# EasyEDA Pro project esp32-board.epro

# Schematic esp32-s3-lite
Board Name: Board1; Create Date: 2025-02-08; Page Name: P1; Project Name: esp32-s3-lite-v4; Schematic Name: esp32-s3-lite; Update Date: 2025-04-16; Company: EasyEDA.com; Drawn: EasyEDA; Page Size: A4; Part Number: JLCPCB-002; Reviewed: EasyEDA; Version: V0.1
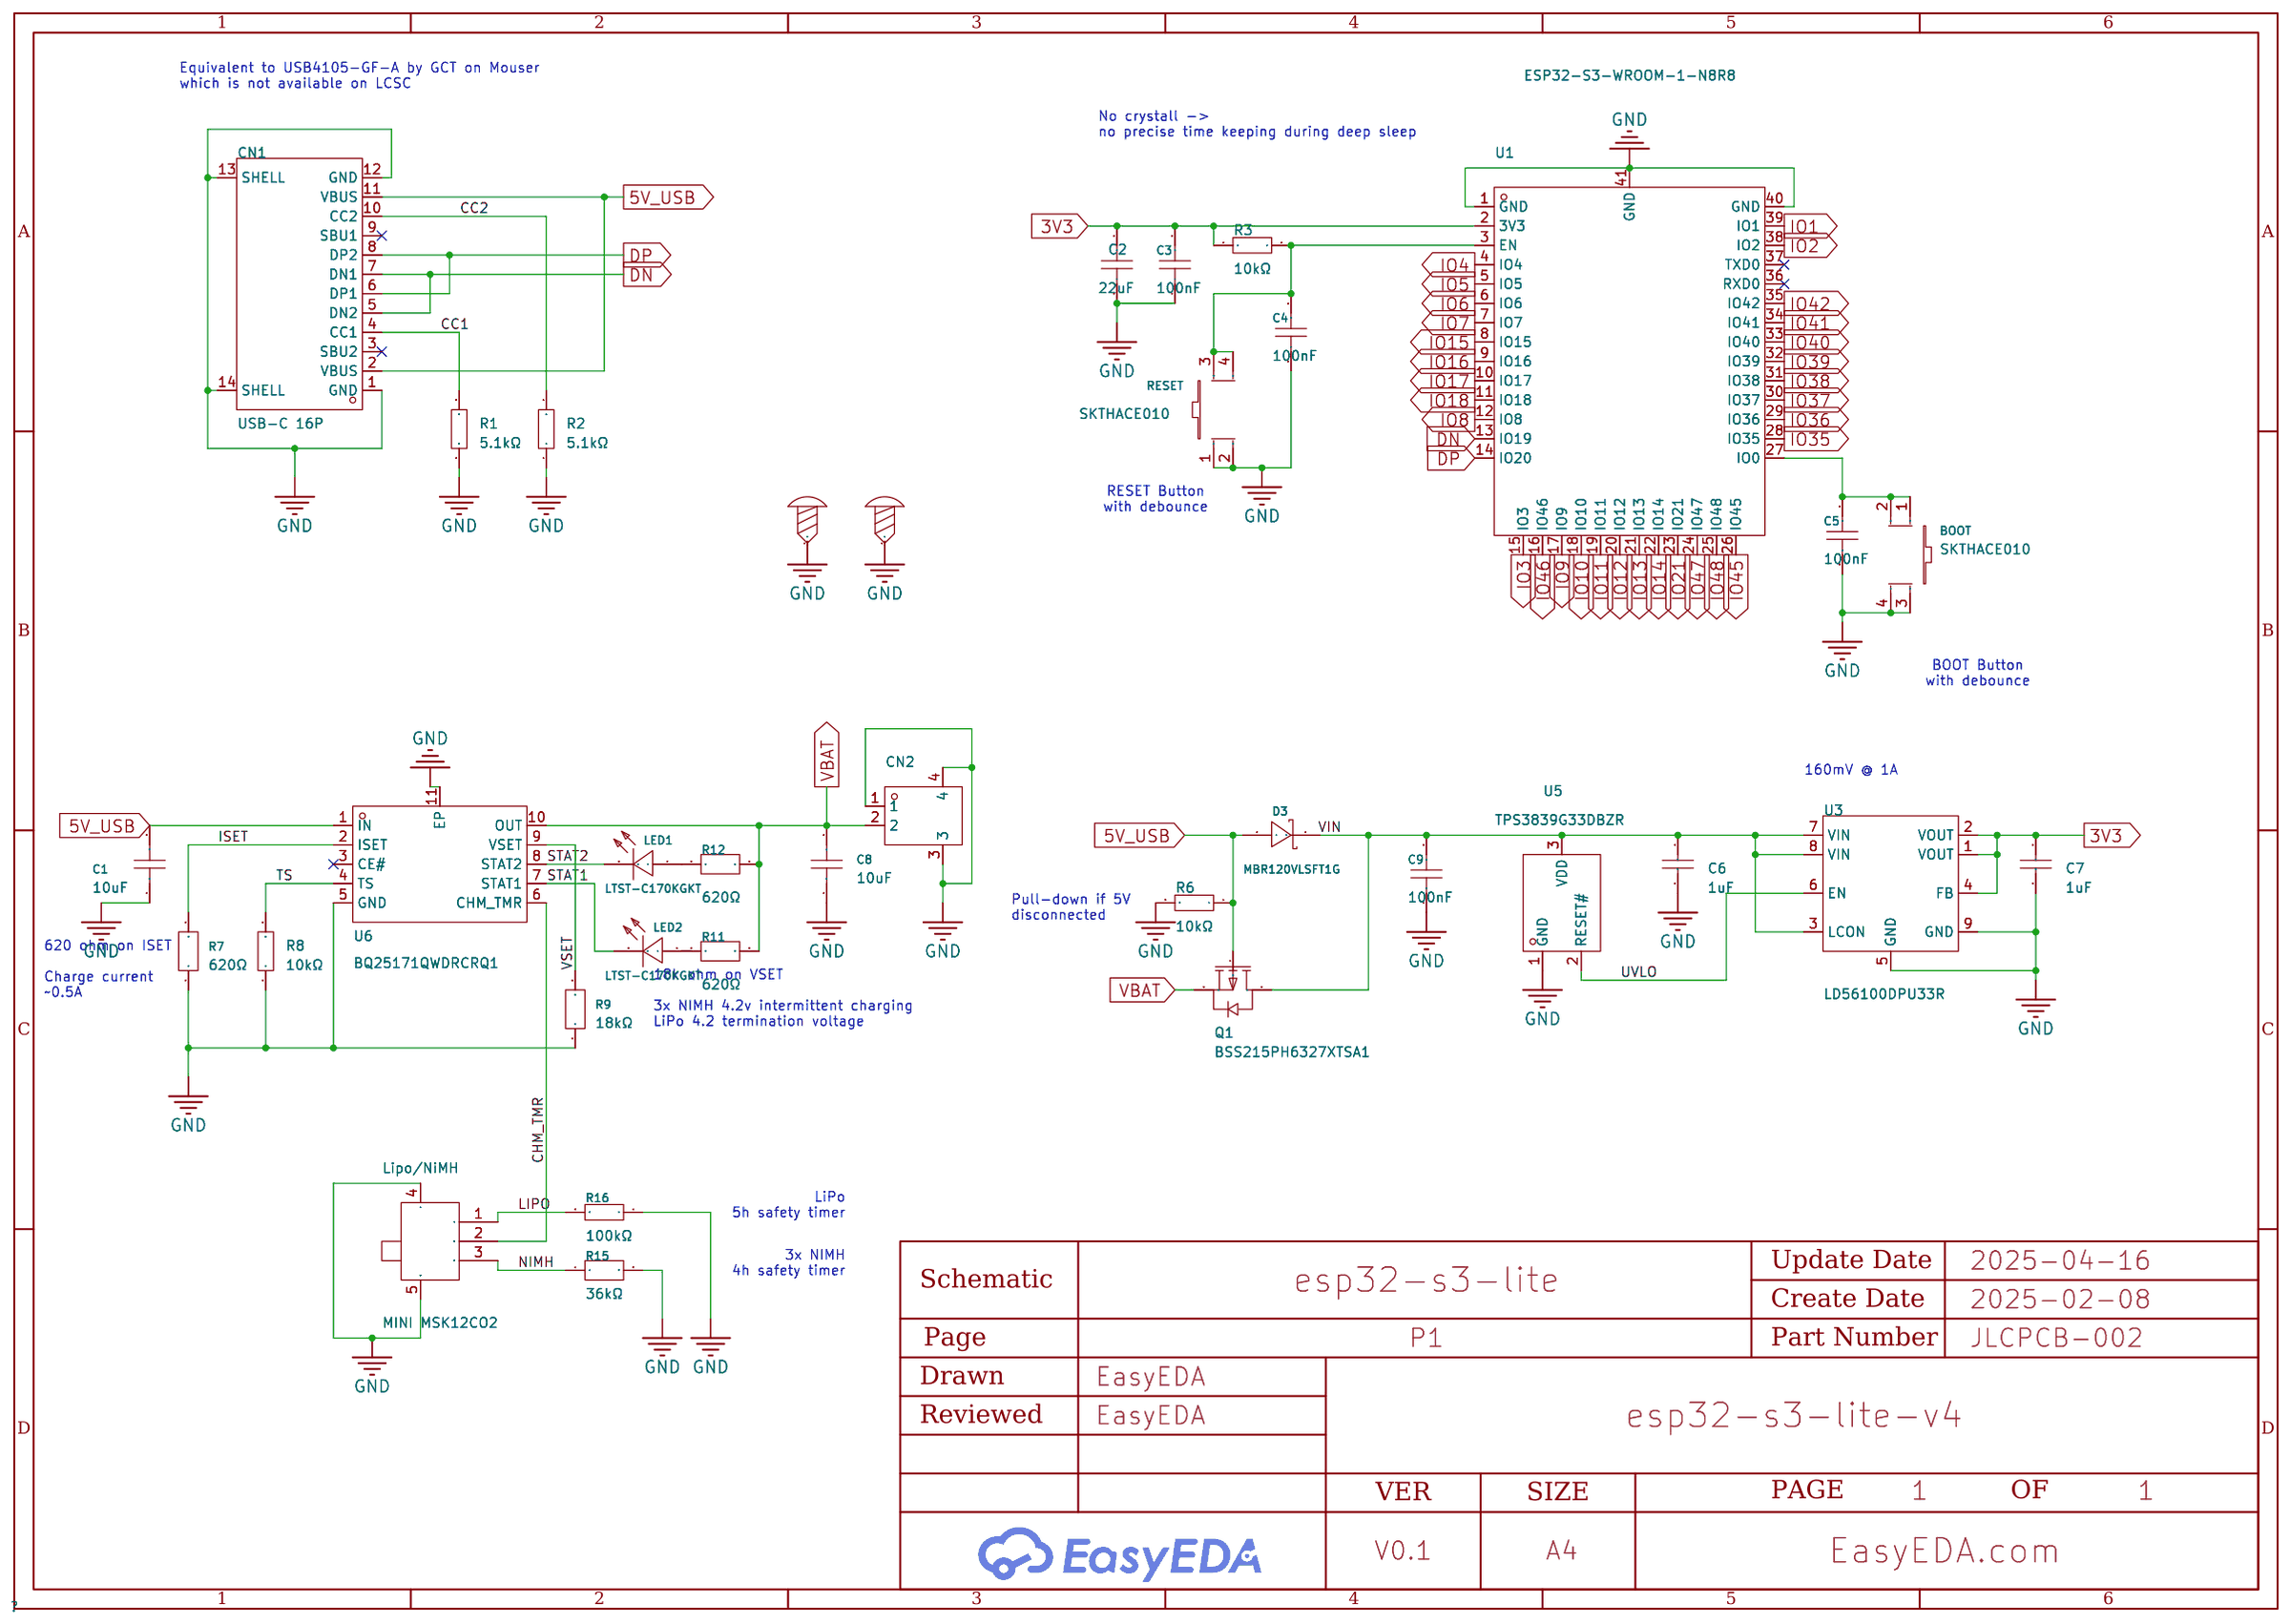
[diagram p0: schematic sheet]

## Parts
BOOT  SKTHACE010  [KEY-SMD_4P-L3.5-W3.2-P1.50-LS3.60]
C1  10uF  [C0603]
C2  22uF  [C0603]
C3  100nF  [C0603]
C4  100nF  [C0603]
C5  100nF  [C0603]
C6  1uF  [C0603]
C7  1uF  [C0603]
C8  10uF  [C0603]
C9  100nF  [C0603]
CN1  USB-C 16P  [USB-C-SMD_TYPE-C-6PIN-2MD-073]
CN2  B2B-PH-SM4-TB(LF)(SN)  [CONN-SMD_B2B-PH-SM4-TB-LF-SN]
D3  MBR120VLSFT1G  [SOD-123F_L2.8-W1.8-LS3.7-RD]
LED1  LTST-C170KGKT  [LED0805-R-RD]
LED2  LTST-C170KGKT  [LED0805-R-RD]
Lipo/NiMH  MINI MSK12CO2  [SW-SMD_MSK12CO2]
Q1  BSS215PH6327XTSA1  [SOT-23-3_L2.9-W1.3-P1.90-LS2.4-BR]
R1  5.1kΩ  [R0603]
R2  5.1kΩ  [R0603]
R3  10kΩ  [R0603]
R6  10kΩ  [R0603]
R7  620Ω  [R0603]
R8  10kΩ  [R0603]
R9  18kΩ  [R0603]
R11  620Ω  [R0603]
R12  620Ω  [R0603]
R15  36kΩ  [R0603]
R16  100kΩ  [R0603]
RESET  SKTHACE010  [KEY-SMD_4P-L3.5-W3.2-P1.50-LS3.60]
SCREW1  -  [Screw-Hole-M2]
SCREW2  -  [Screw-Hole-M2]
U1  ESP32-S3-WROOM-1-N8R8  [WIRELM-SMD_ESP32-S3-WROOM-1]
U3  LD56100DPU33R  [XDFN-8_L1.6-W1.2-P0.40-BL-EP]
U5  TPS3839G33DBZR  [SOT-23-3_L2.9-W1.3-P1.90-LS2.4-BR]
U6  BQ25171QWDRCRQ1  [VSON-10_L3.0-W3.0-P0.50-BL-EP1.65]

## Library data of the parts
BOOT RESET = SKTHACE010: Circuit:SPST Actuator Style:Oval button Mounting Style:Brick nogging Switch Length:3.5mm Switch Width:3.2mm Switch Height:2.5mm Contact Current:25mA Voltage Rating (DC):16V With Lamp:- Mechanical Life:-; LCSC Part Name: 3.5*3.2*2.5mm 立贴 轻触开关; Supplier Part: C341729; Manufacturer: ALPSALPINE(阿尔卑斯阿尔派); Supplier Footprint: SMD; JLCPCB Part Class: Extended Part; Datasheet: https://atta.szlcsc.com/upload/public/pdf/source/20181207/C341729_BBC92D894F29994D0AEA1AC6AF4EADEA.pdf; Supplier: LCSC; Circuit: SPST; Actuator Style: Oval button; Mounting Style: Brick nogging; Switch Length: 3.5mm; Switch Width: 3.2mm; Switch Height: 2.5mm; Contact Current: 25mA; Voltage Rating (DC): 16V
C1 C8 = CL10A106MA8NRNC: Capacitance: Tolerance:±20% Tolerance:±20% Voltage Rated: Temperature Coefficient:; LCSC Part Name: 10uF ±20% 25V; Supplier Part: C96446; Manufacturer: SAMSUNG(三星); Supplier Footprint: 0603; JLCPCB Part Class: Basic Part; Datasheet: https://atta.szlcsc.com/upload/public/pdf/source/20160218/1457707763339.pdf; Supplier: LCSC; Tolerance: ±20%
C2 = CL10A226MP8NUNE: Capacitance: Tolerance:±20% Tolerance:±20% Voltage Rated: Temperature Coefficient:; LCSC Part Name: 22uF ±20% 10V; Supplier Part: C86295; Manufacturer: SAMSUNG(三星); Supplier Footprint: 0603; JLCPCB Part Class: Extended Part; Datasheet: https://atta.szlcsc.com/upload/public/pdf/source/20160218/1457707763339.pdf; Supplier: LCSC; Tolerance: ±20%
C3-C5 C9 = CL10B104KB8NNNC: Capacitance: Tolerance:±10% Tolerance:±10% Voltage Rated: Temperature Coefficient:; LCSC Part Name: 100nF ±10% 50V; Supplier Part: C1591; Manufacturer: SAMSUNG(三星); Supplier Footprint: 0603; JLCPCB Part Class: Extended Part; Datasheet: https://atta.szlcsc.com/upload/public/pdf/source/20160218/1457707763339.pdf; Supplier: LCSC; Tolerance: ±10%
C6 C7 = CL10A105KA8NNNC: Capacitance: Tolerance:±10% Tolerance:±10% Voltage Rated: Temperature Coefficient:; LCSC Part Name: 1uF ±10% 25V; Supplier Part: C5673; Manufacturer: SAMSUNG(三星); Supplier Footprint: 0603; JLCPCB Part Class: Extended Part; Datasheet: https://atta.szlcsc.com/upload/public/pdf/source/20160218/1457707763339.pdf; Supplier: LCSC; Tolerance: ±10%
CN1 = TYPE-C 16PIN 2MD(073): Connector Type:Type-C Standard:USB 3.1 Gender:Female Mounting Style:Horizontal attachment Number of Contacts:16P Number of Ports:1 Current Rating - Power (Max):5A Operating Temperature Range:-25℃~+85℃ Operating Temperature Range:-25℃~+85℃ Rated Voltage (M; LCSC Part Name: Type-C 母 卧贴; Supplier Part: C2765186; Manufacturer: SHOU HAN(首韩); Supplier Footprint: SMD; JLCPCB Part Class: Extended Part; Datasheet: https://atta.szlcsc.com/upload/public/pdf/source/20211123/39B17C16241EAC15C5E277BDA434118E.pdf; Supplier: LCSC; Connector Type: Type-C; Standard: USB 3.1; Gender: Female; Mounting Style: Horizontal attachment; Number of Contacts: 16P; Number of Ports: 1; Current Rating - Power (Max): 5A; Operating Temperature Range: -25℃~+85℃; Rated Voltage (Max): 5V; Connect-Disconnect Life: 5000 Cuts; Core Colour: Black
CN2 = B2B-PH-SM4-TB(LF)(SN): Pins Structure:1x2P Pitch:2mm Mounting Style:Brick nogging Reference Series:PH Number of Pins:2P Number of Rows:1 Number of PINs Per Row:2 Row Spacing:- Current Rating (Max):2A Contact Material:Copper Alloy Contact Plating:Tin Operating Temperature Range:; LCSC Part Name: 1x2P 间距:2mm 立贴 系列:PH; Supplier Part: C160352; Manufacturer: JST; Supplier Footprint: SMD,P=2mm; JLCPCB Part Class: Extended Part; Datasheet: https://atta.szlcsc.com/upload/public/pdf/source/20181010/C265101_22107ACC4D8714694FDA2DD97145FA81.pdf; Supplier: LCSC; Pins Structure: 1x2P; Pitch: 2mm; Mounting Style: Brick nogging; Reference Series: PH; Number of Pins: 2P; Number of Rows: 1; Number of PINs Per Row: 2; Current Rating (Max): 2A; Contact Material: Copper Alloy; Contact Plating: Tin; Operating Temperature Range: -25℃~+85℃; Rated Voltage (Max): 100V; Plastic Material: PA; Flame Retardant Rating: UL94V-0; Supplementary Features: 辅助焊脚; Colour: 米色; Z-Height of the Board: 6.6mm; X-Length of Bottom Edge on Board (Spacing Line): 7.95mm; Y-Width of Bottom Edge on Board: 7mm
D3 = MBR120VLSFT1G: Forward Voltage (Vf@If):300mV@1A Reverse Voltage (Vr):20V Average Rectified Current (Io):1A Reverse Leakage Current (Ir):600uA@20V; LCSC Part Name: 电压:20V 电流:1A; Supplier Part: C223608; Manufacturer: onsemi(安森美); Supplier Footprint: SOD-123FL; JLCPCB Part Class: Extended Part; Datasheet: https://atta.szlcsc.com/upload/public/pdf/source/20221020/29D26ECD33A75D76A8E47ED9553F3BCF.pdf; Supplier: LCSC; Forward Voltage (Vf@If): 300mV@1A; Reverse Voltage (Vr): 20V; Average Rectified Current (Io): 1A; Reverse Leakage Current (Ir): 600uA@20V
LED1 LED2 = LTST-C170KGKT: Emitted Color:Green-yellow Forward Voltage (VF):2V Forward Voltage (VF):2V Power Dissipation:75mW Forward Current:20mA Dominant Wavelength:571nm Dominant Wavelength:571nm Peak Wavelength:574nm Diode Configuration:- Lens Color:无色透明透镜 Color Temperature:- Co; LCSC Part Name: 普绿/黄绿; Supplier Part: C98221; Manufacturer: LITEON(光宝); Supplier Footprint: 0805; JLCPCB Part Class: Extended Part; Datasheet: https://atta.szlcsc.com/upload/public/pdf/source/20180129/C98221_15171889648161316610.pdf; Supplier: LCSC; Emitted Color: Green-yellow; Forward Voltage (VF): 2V; Power Dissipation: 75mW; Forward Current: 20mA; Dominant Wavelength: 571nm; Peak Wavelength: 574nm; Lens Color: 无色透明透镜; Luminous Intensity: 35mcd; Viewing Angle: 130°; Operating Temperature: -55℃~+85℃
Lipo/NiMH = MINI MSK12CO2: Circuit:SPDT Actuator Style:- Pin Style:SMDSplicing Switch Length:5mm Switch Width:2.75mm Switch Height:1.4mm Mounting Style:卧贴 Actuator Color:- Current Rating (DC):50mA Voltage Rating (DC):12V Current Rating (AC):- Voltage Rating (AC):- Mechanical Life:1; LCSC Part Name: 迷你七脚两档侧拨拨动 mini七7脚 微型拨动; Supplier Part: C2681570; Manufacturer: SHOU HAN(首韩); Supplier Footprint: SMD; JLCPCB Part Class: Extended Part; Datasheet: https://atta.szlcsc.com/upload/public/pdf/source/20210224/C2681570_D263F9C605E4588A4AE6114B72AE4C72.pdf; Supplier: LCSC; Circuit: SPDT; Pin Style: SMDSplicing; Switch Length: 5mm; Switch Width: 2.75mm; Switch Height: 1.4mm; Mounting Style: 卧贴; Current Rating (DC): 50mA; Voltage Rating (DC): 12V; Mechanical Life: 1万次; Operating Temperature: -16℃~+60℃
Q1 = BSS215PH6327XTSA1: Type:1 Piece P-Channel Drain Source Voltage (Vdss):20V Continuous Drain Current (Id): Power Dissipation (Pd): Drain Source On Resistance (RDS(on)@Vgs,Id): Gate Threshold Voltage (Vgs(th)@Id):1.2V@11uA Total Gate Charge (Qg@Vgs):3.6nC@4.5V Input Capacitanc; LCSC Part Name: 1个P沟道 耐压:20V 电流:1.5A; Supplier Part: C152736; Manufacturer: Infineon(英飞凌); Supplier Footprint: SOT-23; JLCPCB Part Class: Extended Part; Datasheet: https://atta.szlcsc.com/upload/public/pdf/source/20200519/C534615_D0AFB7F4007BEC6B6D76BB5D3CF0A1A2.pdf; Supplier: LCSC; Type: 1 Piece P-Channel; Drain Source Voltage (Vdss): 20V; Gate Threshold Voltage (Vgs(th)@Id): 1.2V@11uA; Total Gate Charge (Qg@Vgs): 3.6nC@4.5V; Input Capacitance (Ciss@Vds): 346pF@15V; Operating Temperature: -55℃~+150℃@(Tj)
R1 R2 = RT0603BRD075K1L: Type:Thin Film Resistor Resistance: Tolerance:±0.1% Tolerance:±0.1% Power(Watts): Overload Voltage (Max): Temperature Coefficient:±25ppm/℃ Temperature Coefficient:±25ppm/℃ Operating Temperature Range:-55℃~+155℃ Operating Temperature Range:-55℃~+155℃; LCSC Part Name: 薄膜电阻 5.1kΩ ±0.1% 100mW; Supplier Part: C122969; Manufacturer: YAGEO(国巨); Supplier Footprint: 0603; JLCPCB Part Class: Extended Part; Datasheet: https://atta.szlcsc.com/upload/public/pdf/source/20170728/C122969_1501225761505848820.pdf; Supplier: LCSC; Type: Thin Film Resistor; Tolerance: ±0.1%; Temperature Coefficient: ±25ppm/℃; Operating Temperature Range: -55℃~+155℃
R3 R6 R8 = RT0603BRD0710KL: Type:Thin Film Resistor Resistance: Tolerance:±0.1% Tolerance:±0.1% Power(Watts): Overload Voltage (Max): Temperature Coefficient:±25ppm/℃ Temperature Coefficient:±25ppm/℃ Operating Temperature Range:-55℃~+155℃ Operating Temperature Range:-55℃~+155℃; LCSC Part Name: 薄膜电阻 10kΩ ±0.1% 100mW; Supplier Part: C95204; Manufacturer: YAGEO(国巨); Supplier Footprint: 0603; JLCPCB Part Class: Extended Part; Datasheet: https://atta.szlcsc.com/upload/public/pdf/source/20170217/1487301593756.pdf; Supplier: LCSC; Type: Thin Film Resistor; Tolerance: ±0.1%; Temperature Coefficient: ±25ppm/℃; Operating Temperature Range: -55℃~+155℃
R7 R11 R12 = ERJ3EKF6200V: Type:Thick Film Resistors Resistance: Tolerance:±1% Tolerance:±1% Power(Watts): Overload Voltage (Max):- Temperature Coefficient:±100ppm/℃ Temperature Coefficient:±100ppm/℃ Operating Temperature Range:-55℃~+155℃ Operating Temperature Range:-55℃~+155℃; LCSC Part Name: 620Ω ±1% 100mW 厚膜电阻; Supplier Part: C403304; Manufacturer: PANASONIC(松下); Supplier Footprint: 0603; JLCPCB Part Class: Extended Part; Datasheet: https://atta.szlcsc.com/upload/public/pdf/source/20190709/C403410_4AA7B6683950D876CE9308C181828FCD.pdf; Supplier: LCSC; Type: Thick Film Resistors; Tolerance: ±1%; Temperature Coefficient: ±100ppm/℃; Operating Temperature Range: -55℃~+155℃
R9 = ERJ3EKF1802V: Type:Thick Film Resistors Resistance:18kΩ Tolerance:±1% Tolerance:±1% Power(Watts): Overload Voltage (Max): Temperature Coefficient:±100ppm/℃ Temperature Coefficient:±100ppm/℃ Operating Temperature Range:-55℃~+155℃ Operating Temperature Range:-55℃~+155℃; LCSC Part Name: 18kΩ ±1% 100mW 厚膜电阻; Supplier Part: C403034; Manufacturer: PANASONIC(松下); Supplier Footprint: 0603; JLCPCB Part Class: Extended Part; Datasheet: https://atta.szlcsc.com/upload/public/pdf/source/20190709/C403410_4AA7B6683950D876CE9308C181828FCD.pdf; Supplier: LCSC; Type: Thick Film Resistors; Tolerance: ±1%; Temperature Coefficient: ±100ppm/℃; Operating Temperature Range: -55℃~+155℃
R15 = ERJ3EKF3602V: Type:Thick Film Resistors Resistance:36kΩ Tolerance:±1% Tolerance:±1% Power(Watts): Overload Voltage (Max):- Temperature Coefficient:±100ppm/℃ Temperature Coefficient:±100ppm/℃ Operating Temperature Range:-55℃~+155℃ Operating Temperature Range:-55℃~+155℃; LCSC Part Name: 36kΩ ±1% 100mW 厚膜电阻; Supplier Part: C403181; Manufacturer: PANASONIC(松下); Supplier Footprint: 0603; JLCPCB Part Class: Extended Part; Datasheet: https://atta.szlcsc.com/upload/public/pdf/source/20190709/C403410_4AA7B6683950D876CE9308C181828FCD.pdf; Supplier: LCSC; Type: Thick Film Resistors; Tolerance: ±1%; Temperature Coefficient: ±100ppm/℃; Operating Temperature Range: -55℃~+155℃
R16 = ERJ3EKF1003V: Type:Thick Film Resistors Resistance:100kΩ Tolerance:±1% Tolerance:±1% Power(Watts): Overload Voltage (Max):- Temperature Coefficient:±100ppm/℃ Temperature Coefficient:±100ppm/℃ Operating Temperature Range:-55℃~+155℃ Operating Temperature Range:-55℃~+155℃; LCSC Part Name: 100kΩ ±1% 100mW 厚膜电阻; Supplier Part: C189597; Manufacturer: PANASONIC(松下); Supplier Footprint: 0603; JLCPCB Part Class: Extended Part; Datasheet: https://atta.szlcsc.com/upload/public/pdf/source/20180524/C193239_FFEA89BB7F9859C8C42240F47AD03C60.pdf; Supplier: LCSC; Type: Thick Film Resistors; Tolerance: ±1%; Temperature Coefficient: ±100ppm/℃; Operating Temperature Range: -55℃~+155℃
SCREW1 SCREW2 = Screw-Hole-M2: Supplier Footprint: 插件
U1 = ESP32-S3-WROOM-1-N8R8: Supplier Part: C2913201; Manufacturer: ESPRESSIF(乐鑫); Supplier Footprint: SMD,25.5x18mm; JLCPCB Part Class: Extended Part; Datasheet: https://atta.szlcsc.com/upload/public/pdf/source/20240130/9D71F4DF55874C504AB629FEEE3F038E.pdf; Supplier: LCSC
U3 = LD56100DPU33R: Output Type:Fixed Maximum Input Voltage:5.5V Output Voltage:3.3V Output Voltage:3.3V Output Current:1A Dropout Voltage:160mV@(1A) standby current:155uA Feature:ESD Protection；Surge Protection；Short-Circuit  Protection；Low ESR；Thermal Protection(TSD)；Overc; LCSC Part Name: 1A超低压降快速静态超低噪声线性稳压器; Supplier Part: C2969937; Manufacturer: ST(意法半导体); Supplier Footprint: DFN-8(1.2x1.6); JLCPCB Part Class: Extended Part; Datasheet: https://atta.szlcsc.com/upload/public/pdf/source/20220927/260C14BB568125F608A31F1F8EA3901A.pdf; Supplier: LCSC; Output Type: Fixed; Maximum Input Voltage: 5.5V; Output Voltage: 3.3V; Output Current: 1A; Dropout Voltage: 160mV@(1A); standby current: 155uA; Feature: ESD Protection；Surge Protection；Short-Circuit  Protection；Low ESR；Thermal Protection(TSD)；Overcurrent Protection(OCP)；With ability; Operating Temperature: -40℃~+85℃; Output Polarity: Positive electrode; Number of Outputs: 1
U5 = TPS3839G33DBZR: ChipType:Simple reset/Power-on reset Output Type:推挽 Reset Active Level:低电平有效 Threshold Voltage:3.08V Number of Voltages Monitored:1 Reset Timeout:120ms Operating Temperature:-40℃~+85℃@(TA) Operating Temperature:-40℃~+85℃@(TA); Supplier Part: C485802; Manufacturer: TI(德州仪器); Supplier Footprint: SOT-23-3; JLCPCB Part Class: Extended Part; Datasheet: https://www.ti.com/cn/lit/gpn/tps3839; Supplier: LCSC; ChipType: Simple reset/Power-on reset; Output Type: 推挽; Reset Active Level: 低电平有效; Threshold Voltage: 3.08V; Number of Voltages Monitored: 1; Reset Timeout: 120ms; Operating Temperature: -40℃~+85℃@(TA)
U6 = BQ25171QWDRCRQ1: Supplier Part: C2861221; Manufacturer: TI(德州仪器); Supplier Footprint: VSON-10-EP(3x3); JLCPCB Part Class: Extended Part; Datasheet: https://www.ti.com/cn/lit/gpn/bq25171-q1; Supplier: LCSC

## Nets
3V3: C2.2 C3.2 C7.2 R3.1 U1.2(3V3) U3.1(VOUT) U3.2(VOUT) U3.4(FB)
5V_USB: C1.2 CN1.2(VBUS) CN1.11(VBUS) D3.2(A) Q1.1(G) R6.1 U6.1(IN)
GND: BOOT.3 BOOT.4 C1.1 C2.1 C3.1 C4.1 C5.1 C6.1 C7.1 C8.1 C9.1 CN1.1(GND) CN1.12(GND) CN1.13(SHELL) CN1.14(SHELL) CN2.1 CN2.3 CN2.4 Lipo/NiMH.4 Lipo/NiMH.5 R1.1 R2.1 R6.2 R7.1 R8.1 R9.1 R15.2 R16.1 RESET.1 RESET.2 SCREW1.1 SCREW2.1 U1.1(GND) U1.40(GND) U1.41(GND) U3.5(GND) U3.9(GND) U5.1(GND) U6.5(GND) U6.11(EP)
VBAT: C8.2 CN2.2 Q1.2(S) R11.2 R12.2 U6.10(OUT)
VIN: C6.2 C9.2 D3.1(K) Q1.3(D) U3.3(LCON) U3.7(VIN) U3.8(VIN) U5.3(VDD)
CC1: CN1.4(CC1) R1.2
CC2: CN1.10(CC2) R2.2
CHM_TMR: Lipo/NiMH.2 U6.6(CHM_TMR)
DN: CN1.5(DN2) CN1.7(DN1) U1.13(IO19)
DP: CN1.6(DP1) CN1.8(DP2) U1.14(IO20)
IO1: U1.39(IO1)
IO2: U1.38(IO2)
IO3: U1.15(IO3)
IO4: U1.4(IO4)
IO5: U1.5(IO5)
IO6: U1.6(IO6)
IO7: U1.7(IO7)
IO8: U1.12(IO8)
IO9: U1.17(IO9)
IO10: U1.18(IO10)
IO11: U1.19(IO11)
IO12: U1.20(IO12)
IO13: U1.21(IO13)
IO14: U1.22(IO14)
IO15: U1.8(IO15)
IO16: U1.9(IO16)
IO17: U1.10(IO17)
IO18: U1.11(IO18)
IO21: U1.23(IO21)
IO35: U1.28(IO35)
IO36: U1.29(IO36)
IO37: U1.30(IO37)
IO38: U1.31(IO38)
IO39: U1.32(IO39)
IO40: U1.33(IO40)
IO41: U1.34(IO41)
IO42: U1.35(IO42)
IO45: U1.26(IO45)
IO46: U1.16(IO46)
IO47: U1.24(IO47)
IO48: U1.25(IO48)
ISET: R7.2 U6.2(ISET)
LIPO: Lipo/NiMH.1 R16.2
NIMH: Lipo/NiMH.3 R15.1
STAT1: LED2.2(K) U6.7(STAT1)
STAT2: LED1.2(K) U6.8(STAT2)
TS: R8.2 U6.4(TS)
UVLO: U3.6(EN) U5.2(RESET#)
VSET: R9.2 U6.9(VSET)
$1N5784: C4.2 R3.2 RESET.3 RESET.4 U1.3(EN)
$1N5906: BOOT.1 BOOT.2 C5.2 U1.27(IO0)
$1N25469: LED2.1(A) R11.1
$1N25594: LED1.1(A) R12.1

Not connected (* = marked no-connect by the designer): CN1 3(SBU2)* 9(SBU1)*; U1 36(RXD0)* 37(TXD0)*; U6 3(CE#)*

## Notes on the sheet
- Equivalent to USB4105-GF-A by GCT on Mouser
  which is not available on LCSC
- No crystall ->
  no precise time keeping during deep sleep
- RESET Button
  with debounce
- BOOT Button
  with debounce
- 160mV @ 1A
- Pull-down if 5V
  disconnected
- 620 ohm on ISET
  Charge current
  ~0.5A
- 18k ohm on VSET
  3x NIMH 4.2v intermittent charging
  LiPo 4.2 termination voltage
- LiPo
  5h safety timer
- 3x NIMH
  4h safety timer

# Board PCB1
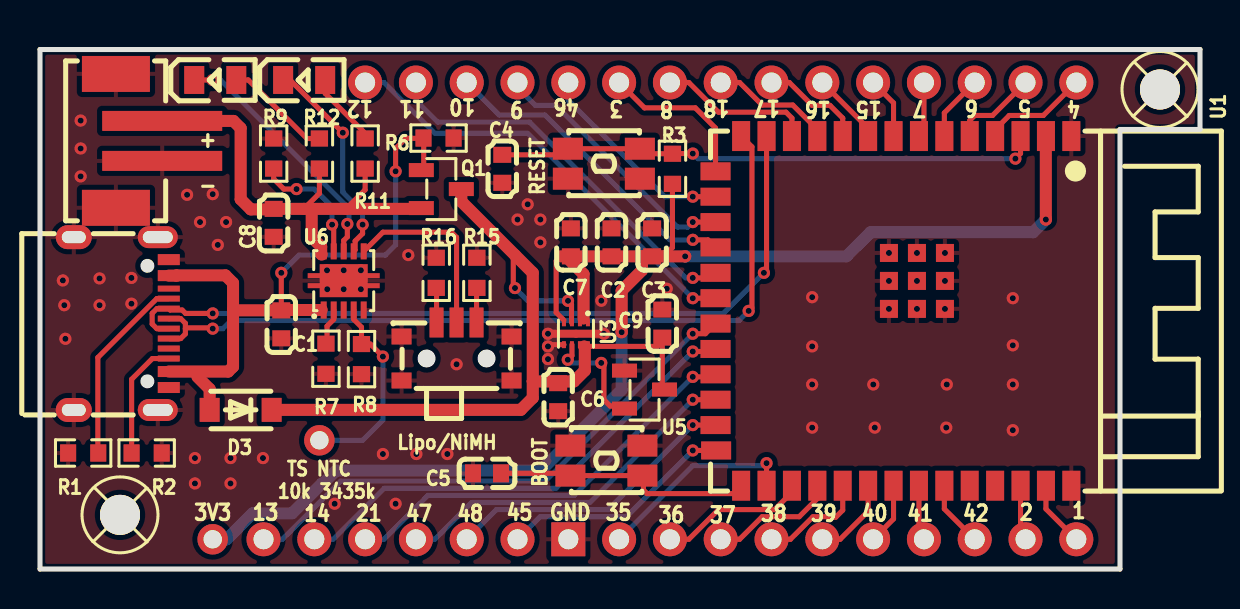
[diagram p1: board, top side]
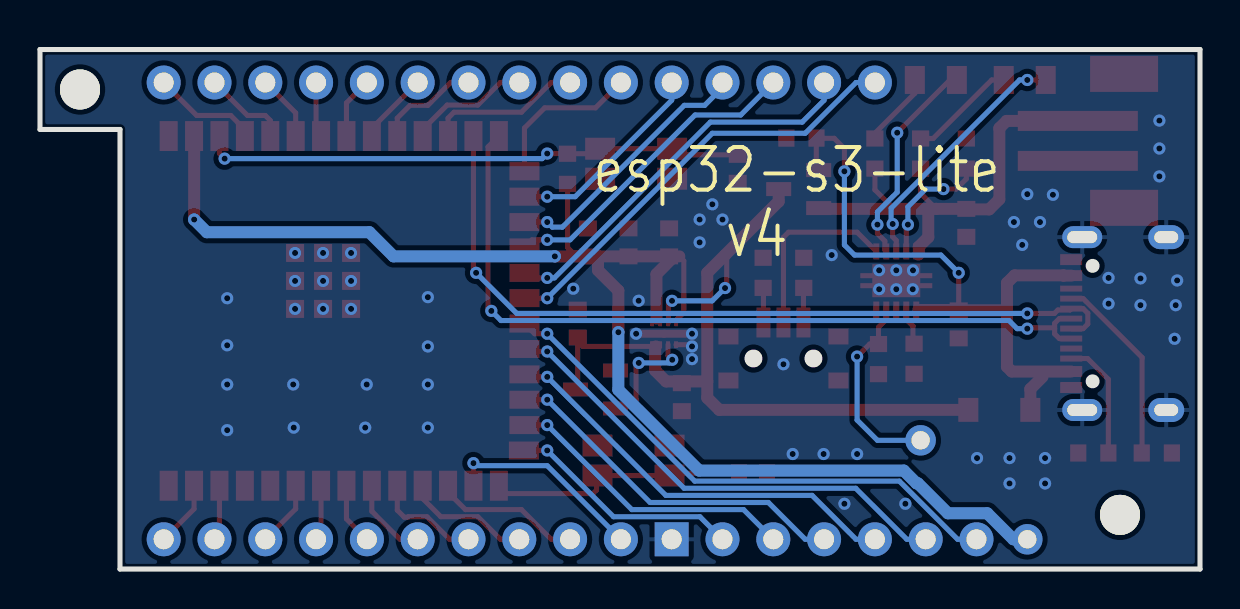
[diagram p2: board, bottom side, seen from below]

Outline 58 x 26 mm; copper layers: Top Layer, Inner1, Inner2, Bottom Layer. Coordinates in mm from the lower left corner of the outline.
Outline path: 0,26 58,26 58,22 54,22 54,0 0,0 0,26
Stack: Top Layer 0.035mm Outer layer thickness 1oz / Dielectric1 0.2104mm 7628 RC49% 8.6mil / Inner1 0.0152mm Inner layer thickness / Dielectric2 1.065mm 1.1mm H/HOZ Copper / Inner2 0.0152mm Inner layer thickness / Dielectric3 0.2104mm 7628 RC49% 8.6mil / Bottom Layer 0.035mm Outer layer thickness 1oz

## Design rules (mm)
template: Custom Config
spacing copperThickness1oz (default): track to track 0.102, other pairs 0.152 to 0.3
spacing copperThickness2oz: track to track 0.203, other pairs 0.152 to 0.3
track width copperThickness1oz (default): min 0.127, default 0.254, max 2.54
track width copperThickness2oz: min 0.203, default 0.254, max 2.54
differential pair differentialPair (default): width min 0.127, default 0.254, max 2.54; gap min 0.152, default 0.152
via viaSize (default): diameter min 0.5, default 0.61, max 10; hole min 0.3, default 0.305, max 6.3

## Placement (name value [footprint] x y rotation side)
BOOT  SKTHACE010  [KEY-SMD_4P-L3.5-W3.2-P1.50-LS3.60]  28.32 5.43 0 top
C1  10uF  [C0603]  12.06 12.25 90 top
C2  22uF  [C0603]  28.57 16.35 270 top
C3  100nF  [C0603]  30.61 16.35 270 top
C4  100nF  [C0603]  23.11 20.03 90 top
C5  100nF  [C0603]  22.35 4.79 0 top
C6  1uF  [C0603]  25.91 8.6 90 top
C7  1uF  [C0603]  26.54 16.35 270 top
C8  10uF  [C0603]  11.68 17.33 90 top
C9  100nF  [C0603]  31.12 12.28 270 top
CN1  USB-C 16P  [USB-C-SMD_TYPE-C-6PIN-2MD-073]  4.06 12.28 270 top
CN2  B2B-PH-SM4-TB(LF)(SN)  [CONN-SMD_B2B-PH-SM4-TB-LF-SN]  4.95 21.43 270 top
D3  MBR120VLSFT1G  [SOD-123F_L2.8-W1.8-LS3.7-RD]  10.03 7.97 180 top
LED1  LTST-C170KGKT  [LED0805-R-RD]  8.76 24.48 0 top
LED2  LTST-C170KGKT  [LED0805-R-RD]  13.21 24.48 0 top
Lipo/NiMH  MINI MSK12CO2  [SW-SMD_MSK12CO2]  20.83 10.89 0 top
NOREF  -  [Pad_e186]  11.18 1.49 180 top
NOREF#2  -  [Pad_e199]  44.2 1.49 180 top
NOREF#3  -  [Pad_e192]  26.42 1.49 180 top
NOREF#4  -  [Pad_e141]  26.42 24.35 180 top
NOREF#5  -  [Pad_e138]  34.04 24.35 180 top
NOREF#6  -  [Pad_e190]  21.34 1.49 180 top
NOREF#7  -  [Pad_e134]  44.2 24.35 180 top
NOREF#8  -  [Pad_e137]  36.58 24.35 180 top
NOREF#9  -  [Pad_e135]  41.66 24.35 180 top
NOREF#10  -  [Pad_e133]  46.74 24.35 180 top
NOREF#11  -  [Pad_e189]  18.8 1.49 180 top
NOREF#12  -  [Pad_e200]  46.74 1.49 180 top
NOREF#13  -  [Pad_e201]  49.28 1.49 180 top
NOREF#14  -  [Pad_e197]  39.12 1.49 180 top
NOREF#15  -  [Pad_e136]  39.12 24.35 180 top
NOREF#16  -  [Pad_e194]  31.5 1.49 180 top
NOREF#17  -  [Pad_e191]  23.88 1.49 180 top
NOREF#18  -  [Pad_e257]  13.97 6.44 0 top
NOREF#19  -  [Pad_e140]  28.96 24.35 180 top
NOREF#20  -  [Pad_e193]  28.96 1.49 180 top
NOREF#21  -  [Pad_e188]  16.26 1.49 180 top
NOREF#22  -  [Pad_e195]  34.04 1.49 180 top
NOREF#23  -  [Pad_e196]  36.58 1.49 180 top
NOREF#24  -  [Pad_e198]  41.66 1.49 180 top
NOREF#25  -  [Pad_e143]  21.34 24.35 180 top
NOREF#26  -  [Pad_e202]  51.82 1.49 180 top
NOREF#27  -  [Pad_e146]  16.26 24.35 180 top
NOREF#28  -  [Pad_e144]  18.8 24.35 180 top
NOREF#29  -  [Pad_e139]  31.5 24.35 180 top
NOREF#30  -  [Pad_e142]  23.88 24.35 180 top
NOREF#31  -  [Pad_e187]  13.72 1.49 180 top
NOREF#32  -  [Pad_e1179]  8.64 1.49 0 top
NOREF#33  -  [Pad_e131]  51.82 24.35 180 top
NOREF#34  -  [Pad_e132]  49.28 24.35 180 top
Q1  BSS215PH6327XTSA1  [SOT-23-3_L2.9-W1.3-P1.90-LS2.4-BR]  20.07 19.02 180 top
R1  5.1kΩ  [R0603]  2.16 5.81 0 top
R2  5.1kΩ  [R0603]  5.33 5.81 180 top
R3  10kΩ  [R0603]  31.62 20.03 90 top
R6  10kΩ  [R0603]  19.93 21.57 0 top
R7  620Ω  [R0603]  14.3 10.52 90 top
R8  10kΩ  [R0603]  16.07 10.51 90 top
R9  18kΩ  [R0603]  11.68 20.79 270 top
R11  620Ω  [R0603]  16.26 20.79 270 top
R12  620Ω  [R0603]  13.97 20.79 270 top
R15  36kΩ  [R0603]  21.84 14.82 90 top
R16  100kΩ  [R0603]  19.81 14.82 270 top
RESET  SKTHACE010  [KEY-SMD_4P-L3.5-W3.2-P1.50-LS3.60]  28.19 20.28 0 top
SCREW1  -  [Screw-Hole-M2]  4 2.71 0 top
SCREW2  -  [Screw-Hole-M2]  56 24 0 top
U1  ESP32-S3-WROOM-1-N8R8  [WIRELM-SMD_ESP32-S3-WROOM-1]  42.67 12.92 270 top
U3  LD56100DPU33R  [XDFN-8_L1.6-W1.2-P0.40-BL-EP]  26.8 11.78 180 top
U5  TPS3839G33DBZR  [SOT-23-3_L2.9-W1.3-P1.90-LS2.4-BR]  30.23 8.98 180 top
U6  BQ25171QWDRCRQ1  [VSON-10_L3.0-W3.0-P0.50-BL-EP1.65]  15.19 14.43 0 top

## Footprints (pads in the part's own frame, mm; a bottom-side part is the same pattern mirrored in y, then rotated)
C0603
  rect 0.8x0.9 smd: 1(-0.7,0) 2(0.7,0)
CONN-SMD_B2B-PH-SM4-TB-LF-SN
  rect 1x6 smd: 1(1.002,1.157) 2(-0.998,1.157)
  rect 1.8x3.4 smd: 3(-3.35,-1.157) 4(3.35,-1.157)
KEY-SMD_4P-L3.5-W3.2-P1.50-LS3.60
  rect 1.5x1.1 smd: 1(-1.8,-0.75) 2(1.8,-0.75) 3(-1.8,0.75) 4(1.8,0.75)
LED0805-R-RD
  rect 1x1.399 smd: 1(1.05,0) 2(-1.05,0)
Pad_e131
  round 1.7 hole 1: 2(0,0)
Pad_e132
  round 1.7 hole 1: 3(0,0)
Pad_e133
  round 1.7 hole 1: 4(0,0)
Pad_e134
  round 1.7 hole 1: 5(0,0)
Pad_e135
  round 1.7 hole 1: 6(0,0)
Pad_e136
  round 1.7 hole 1: 7(0,0)
Pad_e137
  round 1.7 hole 1: 8(0,0)
Pad_e138
  round 1.7 hole 1: 9(0,0)
Pad_e139
  round 1.7 hole 1: 10(0,0)
Pad_e140
  round 1.7 hole 1: 11(0,0)
Pad_e141
  round 1.7 hole 1: 12(0,0)
Pad_e142
  round 1.7 hole 1: 13(0,0)
Pad_e143
  round 1.7 hole 1: 14(0,0)
Pad_e144
  round 1.7 hole 1: 15(0,0)
Pad_e146
  round 1.7 hole 1: 1(0,0)
Pad_e186
  round 1.7 hole 1: 15(0,0)
Pad_e187
  round 1.7 hole 1: 14(0,0)
Pad_e188
  round 1.7 hole 1: 13(0,0)
Pad_e189
  round 1.7 hole 1: 12(0,0)
Pad_e190
  round 1.7 hole 1: 11(0,0)
Pad_e191
  round 1.7 hole 1: 10(0,0)
Pad_e192
  rect 1.7x1.7 hole 1: 9(0,0)
Pad_e193
  round 1.7 hole 1: 8(0,0)
Pad_e194
  round 1.7 hole 1: 7(0,0)
Pad_e195
  round 1.7 hole 1: 6(0,0)
Pad_e196
  round 1.7 hole 1: 5(0,0)
Pad_e197
  round 1.7 hole 1: 4(0,0)
Pad_e198
  round 1.7 hole 1: 3(0,0)
Pad_e199
  round 1.7 hole 1: 2(0,0)
Pad_e200
  round 1.7 hole 1: 1(0,0)
Pad_e201
  round 1.7 hole 1: 2(0,0)
Pad_e202
  round 1.7 hole 1: 1(0,0)
Pad_e257
  round 1.524 hole 0.914: 1(0,0)
Pad_e1179
  round 1.524 hole 0.914: 1(0,0)
R0603
  rect 0.806x0.864 smd: 1(-0.753,0) 2(0.753,0)
Screw-Hole-M2
  round 2 hole 2: 1(0,0)
SOD-123F_L2.8-W1.8-LS3.7-RD
  rect 1x1.2 smd: 1(-1.55,0) 2(1.55,0)
SOT-23-3_L2.9-W1.3-P1.90-LS2.4-BR
  rect 1.25x0.7 smd: 1(1,-0.95) 2(1,0.95) 3(-1,0)
SW-SMD_MSK12CO2
  rect 0.7x1.5 smd: 1(-1,1.45) 2(0,1.45) 3(1,1.45)
  rect 1x0.8 smd: 4(-2.75,0.75) 4(-2.75,-1.45) 5(2.75,0.75) 5(2.75,-1.45)
USB-C-SMD_TYPE-C-6PIN-2MD-073
  rect 0.55x1.1 smd: 1(-3.2,2.375) 2(-2.4,2.375) 11(2.4,2.375) 12(3.2,2.375)
  rect 0.3x1.1 smd: 3(-1.75,2.375) 4(-1.25,2.375) 5(-0.75,2.375) 6(-0.25,2.375) 7(0.25,2.375) 8(0.75,2.375) 9(1.25,2.375) 10(1.75,2.375)
  oval 1.1x2 hole 0.6x1.5: 13(-4.325,1.825) 14(4.325,1.825)
  oval 1.2x1.8 hole 0.6x1.2: 13(-4.325,-2.375) 14(4.325,-2.375)
VSON-10_L3.0-W3.0-P0.50-BL-EP1.65
  rect 0.3x0.85 smd: 1(-1,-1.468) 2(-0.5,-1.468) 3(0,-1.468) 4(0.5,-1.468) 5(1,-1.468)
  rect 0.3x0.8 smd: 6(1,1.468) 7(0.5,1.468) 8(0,1.468) 9(-0.5,1.468) 10(-1,1.468)
  custom 3.6x1.65 smd: 11(0,0)
WIRELM-SMD_ESP32-S3-WROOM-1
  rect 1.5x0.9 smd: 1(-8.75,8.895) 2(-8.75,7.625) 3(-8.75,6.355) 4(-8.75,5.085) 5(-8.75,3.815) 6(-8.75,2.545) 7(-8.75,1.275) 8(-8.75,0.005) 9(-8.75,-1.265) 10(-8.75,-2.535) 11(-8.75,-3.805) 12(-8.75,-5.075) 13(-8.75,-6.345) 14(-8.75,-7.615) 27(8.75,-7.615) 28(8.75,-6.345) 29(8.75,-5.075) 30(8.75,-3.805) 31(8.75,-2.535) 32(8.75,-1.265) 33(8.75,0.005) 34(8.75,1.275) 35(8.75,2.545) 36(8.75,3.815) 37(8.75,5.085) 38(8.75,6.355) 39(8.75,7.625) 40(8.75,8.895)
  rect 0.9x1.5 smd: 15(-6.985,-8.895) 16(-5.715,-8.895) 17(-4.445,-8.895) 18(-3.175,-8.895) 19(-1.905,-8.895) 20(-0.635,-8.895) 21(0.635,-8.895) 22(1.905,-8.895) 23(3.175,-8.895) 24(4.445,-8.895) 25(5.715,-8.895) 26(6.985,-8.865)
  rect 0.9x0.9 smd: 41(-2.9,2.575) 41(-2.9,1.175) 41(-2.9,-0.225) 41(-1.5,2.575) 41(-1.5,1.175) 41(-1.5,-0.225) 41(-0.1,2.575) 41(-0.1,1.175) 41(-0.1,-0.225)
XDFN-8_L1.6-W1.2-P0.40-BL-EP
  rect 0.2x0.345 smd: 1(-0.6,-0.547) 2(-0.2,-0.547) 3(0.2,-0.547) 4(0.6,-0.547) 5(0.6,0.547) 6(0.2,0.547) 7(-0.2,0.547) 8(-0.6,0.547)
  rect 1.3x0.3 smd: 9(0,0)

## Nets
3V3: C2.2 C3.2 C7.2 NOREF#32.1 R3.1 U1.2 U3.1 U3.2 U3.4
5V_USB: C1.2 CN1.2 CN1.11 D3.2 Q1.1 R6.1 U6.1
GND: BOOT.3 BOOT.4 C1.1 C2.1 C3.1 C4.1 C5.1 C6.1 C7.1 C8.1 C9.1 CN1.1 CN1.12 CN1.13 CN1.14 CN2.1 CN2.3 CN2.4 Lipo/NiMH.4 Lipo/NiMH.5 NOREF#3.9 R1.1 R2.1 R6.2 R7.1 R8.1 R9.1 R15.2 R16.1 RESET.1 RESET.2 U1.1 U1.40 U1.41 U3.5 U3.9 U5.1 U6.5 U6.11
VBAT: C8.2 CN2.2 Q1.2 R11.2 R12.2 U6.10
VIN: C6.2 C9.2 D3.1 Q1.3 U3.3 U3.7 U3.8 U5.3
CC1: CN1.4 R1.2
CC2: CN1.10 R2.2
CHM_TMR: Lipo/NiMH.2 U6.6
DN: CN1.5 CN1.7 U1.13
DP: CN1.6 CN1.8 U1.14
IO1: NOREF#26.1 U1.39
IO2: NOREF#13.2 U1.38
IO3: NOREF#19.11 U1.15
IO4: NOREF#33.2 U1.4
IO5: NOREF#34.3 U1.5
IO6: NOREF#10.4 U1.6
IO7: NOREF#7.5 U1.7
IO8: NOREF#29.10 U1.12
IO9: NOREF#30.13 U1.17
IO10: NOREF#25.14 U1.18
IO11: NOREF#28.15 U1.19
IO12: NOREF#27.1 U1.20
IO13: NOREF.15 U1.21
IO14: NOREF#31.14 U1.22
IO15: NOREF#9.6 U1.8
IO16: NOREF#15.7 U1.9
IO17: NOREF#8.8 U1.10
IO18: NOREF#5.9 U1.11
IO21: NOREF#21.13 U1.23
IO35: NOREF#20.8 U1.28
IO36: NOREF#16.7 U1.29
IO37: NOREF#22.6 U1.30
IO38: NOREF#23.5 U1.31
IO39: NOREF#14.4 U1.32
IO40: NOREF#24.3 U1.33
IO41: NOREF#2.2 U1.34
IO42: NOREF#12.1 U1.35
IO45: NOREF#17.10 U1.26
IO46: NOREF#4.12 U1.16
IO47: NOREF#11.12 U1.24
IO48: NOREF#6.11 U1.25
ISET: R7.2 U6.2
LIPO: Lipo/NiMH.1 R16.2
NIMH: Lipo/NiMH.3 R15.1
STAT1: LED2.2 U6.7
STAT2: LED1.2 U6.8
TS: NOREF#18.1 R8.2 U6.4
UVLO: U3.6 U5.2
VSET: R9.2 U6.9
$1N5784: C4.2 R3.2 RESET.3 RESET.4 U1.3
$1N5906: BOOT.1 BOOT.2 C5.2 U1.27
$1N25469: LED2.1 R11.1
$1N25594: LED1.1 R12.1

Pads without a net: CN1 3 9; SCREW1 1; SCREW2 1; U1 36 37; U6 3

## Via types
v1: diameter 0.61, hole 0.305, Top Layer to Bottom Layer, 98 vias

## Routing (per net, layer and track width the routed paths; a pad name or vN(x,y) marks a point on that pad's centre or on a via; arc(x,y) is an arc through that point)
3V3: length 70.7
  Top Layer w0.254: 26.03,15.65 25.81,15.42 25.81,12.84 26.2,12.45 ; 31.18,15.65 31.62,16.09 31.62,19.02 31.88,19.28
  Top Layer w0.6: 26.03,15.65 26.29,15.65 ; 26.29,15.65 27.18,14.76 27.18,12.54 ; 26.29,15.65 C2.2 30.1,15.65 ; v1(32.26,15.65) C3.2 30.1,15.65 ; 30.1,15.65 30.1,14.95 29.08,13.94 v1(29.08,11.85) ; U1.2 50.29,21.66 v1(50.29,17.49)
  Bottom Layer w0.6: v1(32.26,15.65) 40.32,15.65 41.53,16.86 49.66,16.86 v1(50.29,17.49) ; NOREF#32.1 9.33,1.49 10.64,2.79 12.6,2.79 14.1,4.29 14.17,4.29 14.81,4.93 25.04,4.93 29.08,8.97 v1(29.08,11.85)
5V_USB: length 33.5
  Top Layer w0.254: Q1.1 19.19,20.08 19.19,21.56 18.29,21.56 17.78,21.05 v1(17.78,19.9) ; C1.2 v1(12.06,14.82)
  Top Layer w0.6: 7.87,9.62 8.48,9.01 8.48,7.97 ; 9.65,12.95 9.65,14.32 9.27,14.7 6.83,14.7 6.82,14.68 CN1.2 ; 9.65,12.95 C1.2 12.08,12.96 14.08,12.96 ; 9.65,12.95 9.65,10.12 9.41,9.88 CN1.11
  Bottom Layer w0.254: v1(17.78,19.9) 17.78,16.22 17.27,15.71 12.95,15.71 v1(12.06,14.82)
GND: length 3.6
  Top Layer w0.254: U3.5 25.49,11.23 v1(25.4,11.14)
  Top Layer w0.4: v1(25.4,11.78) U3.9 v1(28.19,11.78)
  vias: v1(1.14,14.44) v1(1.21,13.2) v1(1.27,11.52) v1(2.03,22.44) v1(2.03,21.05) v1(2.03,19.65) v1(2.98,14.54) v1(2.98,13.2) v1(4.57,14.57) v1(4.57,13.28) v1(7.35,18.73) v1(7.75,5.55) v1(7.75,4.28) v1(8,17.36) v1(8.64,18.76) v1(8.89,16.22) v1(9.3,17.36) v1(9.53,5.55) v1(9.53,4.28) v1(11.15,5.55) v1(14.35,14.95) v1(14.36,14) v1(14.73,3.27) v1(15.19,14.95) v1(15.19,14) v1(16.04,14.95) v1(16.04,14) v1(17.15,5.76) v1(17.78,3.27) v1(18.41,15.71) v1(18.82,5.76) v1(20.37,5.76) v1(20.83,10.25) v1(23.88,17.49) v1(24.38,18.25) v1(25.02,17.49) v1(25.02,16.35) v1(25.4,10.51) v1(28.07,13.43) v1(31.34,14.03) v1(38.61,13.61) v1(38.61,11.14) v1(38.61,9.24) v1(38.61,7.08) v1(41.66,9.24) v1(41.74,7.08) v1(42.45,15.82) v1(42.45,14.42) v1(42.45,13.02) v1(43.85,15.82) v1(43.85,14.42) v1(43.85,13.02) v1(45.25,15.82) v1(45.25,14.42) v1(45.25,13.02) v1(45.34,9.24) v1(45.31,7.08) v1(48.64,13.55) v1(48.64,11.2) v1(48.64,9.24) v1(48.64,6.95)
VBAT: length 23.9
  Top Layer w0.254: R11.2 16.26,18.98 15.3,18.03 ; 13.19,18.03 13.97,18.8 R12.2
  Top Layer w0.6: CN2.2 9.67,22.43 10.03,22.06 10.03,18.51 10.54,18 11.66,18 C8.2 13.59,18.03 ; 13.59,18.03 13.59,16.61 14.06,16.13 14.06,15.76 14.08,15.74 ; 13.59,18.03 18.85,18.03
VIN: length 41.7
  Top Layer w0.254: 27.21,11.14 30.86,11.14 31.12,11.39 ; 31.12,11.39 C9.2 ; 31.12,11.39 31.12,9.09 U5.3 ; v1(23.75,14.06) 23.66,14.15 23.66,15.63 23.75,15.71 ; 26.58,12.33 26.58,13.25 v1(26.4,13.42)
  Top Layer w0.6: Q1.3 21.07,18.4 24.64,14.82 24.64,9.39 ; 24.64,9.39 26.69,9.39 27.24,9.93 27.24,11.11 27.21,11.14 ; 24.64,9.39 24.64,8.57 24.04,7.97 D3.1
  Bottom Layer w0.254: v1(23.75,14.06) 24.39,13.42 v1(26.4,13.42)
CC1: length 9.2
  Top Layer w0.254: 2.89,6.14 2.89,10.59 5.84,13.53 CN1.4
CC2: length 5.6
  Top Layer w0.254: CN1.10 5.62,10.53 4.58,9.5 4.58,6.19
CHM_TMR: length 9.4
  Top Layer w0.254: U6.6 17.14,16.86 20.57,16.86 20.83,16.6 Lipo/NiMH.2
DN: length 40
  Top Layer w0.254: U1.13 36.33,14.96 v1(36.19,14.82) ; CN1.7 6.44,12.03 5.84,12.03 5.61,12.26 5.61,12.8 5.84,13.03 CN1.5 6.51,12.96 7.11,12.96 7.28,12.79 v1(8.64,12.79)
  Bottom Layer w0.254: v1(36.19,14.82) 34.16,12.79 v1(8.64,12.79)
DP: length 40
  Top Layer w0.254: U1.14 35.6,21.13 35.6,13.08 v1(35.43,12.92) ; 7.27,12.03 7.27,11.77 7.03,11.53 CN1.8 ; 7.27,12.03 7.27,12.3 7.03,12.54 6.44,12.54 CN1.6 ; 7.27,12.03 7.31,12.07 8.6,12.07 v1(8.64,12.03)
  Bottom Layer w0.254: v1(8.64,12.03) 9.14,12.03 9.55,12.44 34.95,12.44 v1(35.43,12.92)
IO1: length 3.3
  Top Layer w0.254: NOREF#26.1 50.3,3.01 U1.39
IO2: length 2.8
  Top Layer w0.254: U1.38 49.03,1.74 NOREF#13.2
IO3: length 7.9
  Top Layer w0.254: U1.15 33.78,22.07 32.77,23.08 30.23,23.08 NOREF#19.11
IO4: length 5.4
  Top Layer w0.254: NOREF#33.2 50.16,22.7 48.46,22.7 47.76,21.99 U1.4
IO5: length 4.4
  Top Layer w0.254: U1.5 46.49,22.45 46.74,22.7 47.62,22.7 NOREF#34.3
IO6: length 3.3
  Top Layer w0.254: U1.6 45.22,22.83 NOREF#10.4
IO7: length 2.8
  Top Layer w0.254: NOREF#7.5 44.2,21.92 U1.7
IO8: length 7.7
  Top Layer w0.254: U1.12 37.6,22.57 37.3,22.86 33.92,22.86 32.44,24.35 NOREF#29.10
IO9: length 13.2
  Top Layer w0.254: U1.17 v1(32.64,17.36)
  Bottom Layer w0.254: v1(32.64,17.36) 32.38,17.11 31.88,17.11 25.79,23.21 24.76,23.21 23.88,24.09 NOREF#30.13
IO10: length 15.9
  Top Layer w0.254: U1.18 33.4,16.47 v1(32.64,16.47)
  Bottom Layer w0.254: v1(32.64,16.47) 31.5,16.47 25.25,22.72 22.96,22.72 NOREF#25.14
IO11: length 19.7
  Top Layer w0.254: v1(32.64,14.57) 33.52,14.57 U1.19
  Bottom Layer w0.254: NOREF#28.15 18.8,23.46 19.89,22.37 24.48,22.37 32.28,14.57 v1(32.64,14.57)
IO12: length 22
  Top Layer w0.254: U1.20 v1(32.64,13.55)
  Bottom Layer w0.254: v1(32.64,13.55) 24.38,21.81 19.74,21.81 17.2,24.35 NOREF#27.1
IO13: length 27.1
  Top Layer w0.254: U1.21 33.27,11.78 v1(32.64,11.78)
  Bottom Layer w0.254: NOREF.15 12.12,1.49 15.03,4.4 25.26,4.4 v1(32.64,11.78)
IO14: length 24
  Top Layer w0.254: U1.22 33.65,10.89 v1(32.64,10.89)
  Bottom Layer w0.254: v1(32.64,10.89) 25.79,4.04 17.21,4.04 14.66,1.49 NOREF#31.14
IO15: length 3.1
  Top Layer w0.254: NOREF#9.6 42.68,23.33 U1.8
IO16: length 3.6
  Top Layer w0.254: U1.9 41.41,22.06 NOREF#15.7
IO17: length 5.2
  Top Layer w0.254: U1.10 40.14,22.57 39.5,23.21 38.61,23.21 37.47,24.35 NOREF#8.8
IO18: length 6.1
  Top Layer w0.254: NOREF#5.9 34.98,24.35 36.11,23.22 37.64,23.22 38.87,21.99 U1.11
IO21: length 20.9
  Top Layer w0.254: v1(32.64,9.62) 33.65,9.62 U1.23
  Bottom Layer w0.254: v1(32.64,9.62) 26.71,3.69 19.4,3.69 17.2,1.49 NOREF#21.13
IO35: length 10.1
  Top Layer w0.254: U1.28 v1(36.33,5.3)
  Bottom Layer w0.254: v1(36.33,5.3) 36.2,5.17 32.64,5.17 NOREF#20.8
IO36: length 7.4
  Top Layer w0.254: U1.29 37.6,3.84 36.73,2.97 33.92,2.97 32.44,1.49 NOREF#16.7
IO37: length 6.3
  Top Layer w0.254: NOREF#22.6 34.98,1.49 36.11,2.62 37.96,2.62 38.87,3.53 U1.30
IO38: length 5.4
  Top Layer w0.254: NOREF#23.5 37.52,1.49 38.65,2.62 39.58,2.62 39.61,2.6 39.79,2.6 40.14,2.95 U1.31
IO39: length 4.1
  Top Layer w0.254: NOREF#14.4 40,1.49 41.41,2.89 U1.32
IO40: length 3.1
  Top Layer w0.254: NOREF#24.3 42.68,2.51 U1.33
IO41: length 2.8
  Top Layer w0.254: U1.34 43.95,1.74 NOREF#2.2
IO42: length 3.3
  Top Layer w0.254: U1.35 45.22,3.01 NOREF#12.1
IO45: length 11.8
  Top Layer w0.254: U1.26 v1(32.64,5.93)
  Bottom Layer w0.254: NOREF#17.10 25,2.62 29.32,2.62 v1(32.64,5.93)
IO46: length 10.2
  Top Layer w0.254: U1.16 v1(32.64,18.63)
  Bottom Layer w0.254: NOREF#4.12 26.42,23.46 31.24,18.63 v1(32.64,18.63)
IO47: length 17.9
  Top Layer w0.254: U1.24 v1(32.64,8.47)
  Bottom Layer w0.254: v1(32.64,8.47) 27.5,3.33 21.58,3.33 19.74,1.49 NOREF#11.12
IO48: length 14.8
  Top Layer w0.254: U1.25 v1(32.64,7.2)
  Bottom Layer w0.254: v1(32.64,7.2) 28.41,2.97 22.82,2.97 NOREF#6.11
ISET: length 1.8
  Top Layer w0.254: R7.2 14.35,11.33 14.35,12.16 14.69,12.49 U6.2
LIPO: length 1.7
  Top Layer w0.254: R16.2 19.83,14.05 Lipo/NiMH.1
NIMH: length 1.8
  Top Layer w0.254: 21.72,14.07 21.83,13.96 Lipo/NiMH.3
STAT1: length 10.6
  Top Layer w0.254: v1(16.13,17.24) 16.13,16.79 15.76,16.41 15.76,15.97 U6.7 ; v1(15.14,21.84) 12.5,24.48 LED2.2
  Bottom Layer w0.254: v1(16.13,17.24) 16.13,17.87 15.14,18.86 v1(15.14,21.84)
STAT2: length 12.7
  Top Layer w0.254: v1(15.37,17.27) 15.37,16.62 15.19,16.44 U6.8 ; v1(8.64,24.48) LED1.2
  Bottom Layer w0.254: v1(8.64,24.48) 9.02,24.48 15.44,18.05 15.44,17.34 v1(15.37,17.27)
TS: length 10
  Top Layer w0.254: U6.4 15.69,12.49 16.07,12.11 R8.2 16.52,11.26 v1(17.15,10.63)
  Bottom Layer w0.254: v1(17.15,10.63) 17.15,7.46 16.13,6.44 NOREF#18.1
UVLO: length 5.5
  Top Layer w0.254: v1(28.06,10.32) 28.19,10.18 28.19,8.47 28.51,8.16 29.1,8.16 ; U3.6 26.6,10.68 v1(26.39,10.47)
  Bottom Layer w0.254: v1(28.06,10.32) 26.55,10.32 v1(26.39,10.47)
VSET: length 6.3
  Top Layer w0.254: R9.2 11.68,19.52 12.19,19.02 v1(12.83,19.02) ; U6.9 14.69,17.16 v1(14.6,17.24)
  Bottom Layer w0.254: v1(14.6,17.24) 14.6,18.13 13.72,19.02 v1(12.83,19.02)
$1N5784: length 27.1
  Top Layer w0.254: C4.2 26.09,20.73 RESET.3 RESET.4 ; v1(32.64,20.79) 31.89,20.79 31.88,20.78 30,20.78 29.99,20.78 ; v1(48.77,20.54) 49.03,20.8 U1.3
  Bottom Layer w0.254: v1(32.64,20.79) 32.89,20.54 v1(48.77,20.54)
$1N5906: length 13.2
  Top Layer w0.254: C5.2 26.41,4.79 BOOT.1 BOOT.2 ; U1.27 34.66,3.78 30.35,3.78 30.17,3.95 30.17,4.88 30.12,4.93
$1N25469: length 3.8
  Top Layer w0.254: R11.1 16.26,21.81 14.26,23.81 LED2.1
$1N25594: length 5.4
  Top Layer w0.254: LED1.1 10.41,24.48 13.34,21.55 R12.1

## Copper pours and planes (outline as drawn; the poured copper is in the pictures)
GND on Top Layer: 0,26 58,26 58,22 54,22 54,0 0,0
GND on Bottom Layer: 0,26 58,26 58,22 54,22 54,0 0,0
GND on Inner1: 0.26,25.74 57.74,25.74 57.74,0.26 0.26,0.26
GND on Inner2: 0.26,25.74 57.74,25.74 57.74,0.26 0.26,0.26

Small or netless copper shapes (teardrops, artwork), in the pictures only: 19 on Inner1, 19 on Inner2

## Text on the board
Bottom Silkscreen Layer: v4 | esp32-s3-lite
Top Silkscreen Layer: TS NTC / 10k 3435k | 3V3 | + | - | 13 | 14 | 21 | 47 | 48 | 45 | GND | 35 | 36 | 37 | 38 | 39 | 40 | 41 | 42 | 2 | 1 | 12 | 11 | 10 | 9 | 46 | 3 | 8 | 18 | 17 | 16 | 15 | 7 | 6 | 5 | 4
